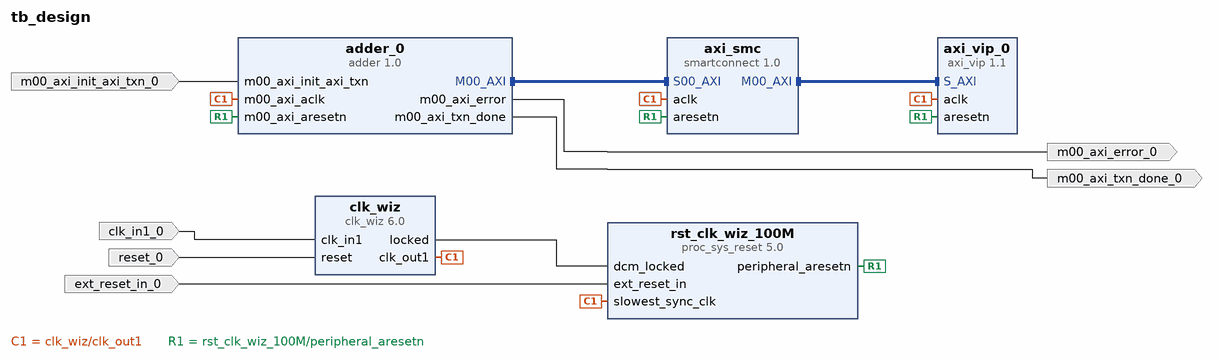
[diagram p0: block diagram of the top level]
# Vivado block design tb_design, xcvu13p-fhgb2104-2-e, Vivado 2025.2
create_bd_design tb_design

create_bd_port -dir I m00_axi_init_axi_txn_0
create_bd_port -dir O m00_axi_txn_done_0
create_bd_port -dir O m00_axi_error_0
create_bd_port -dir I -type clk clk_in1_0
create_bd_port -dir I -type rst reset_0
set_property -dict {CONFIG.POLARITY ACTIVE_HIGH} [get_bd_ports reset_0]
create_bd_port -dir I -type rst ext_reset_in_0

create_bd_cell -type ip -vlnv user.org:user:adder:1.0 adder_0
set_property -dict [list \
  CONFIG.C_M00_AXI_ARUSER_WIDTH 0 \
  CONFIG.C_M00_AXI_AWUSER_WIDTH 0 \
  CONFIG.C_M00_AXI_BURST_LEN 1 \
  CONFIG.C_M00_AXI_BUSER_WIDTH 0 \
  CONFIG.C_M00_AXI_RUSER_WIDTH 0 \
  CONFIG.C_M00_AXI_WUSER_WIDTH 0 \
] [get_bd_cells adder_0]
create_bd_cell -type ip -vlnv xilinx.com:ip:axi_vip:1.1 axi_vip_0
set_property -dict {CONFIG.INTERFACE_MODE SLAVE} [get_bd_cells axi_vip_0]
create_bd_cell -type ip -vlnv xilinx.com:ip:smartconnect:1.0 axi_smc
set_property -dict {CONFIG.NUM_SI 1} [get_bd_cells axi_smc]
create_bd_cell -type ip -vlnv xilinx.com:ip:clk_wiz:6.0 clk_wiz
create_bd_cell -type ip -vlnv xilinx.com:ip:proc_sys_reset:5.0 rst_clk_wiz_100M

# ---- connections ----

connect_bd_intf_net [get_bd_intf_pins adder_0/M00_AXI] [get_bd_intf_pins axi_smc/S00_AXI]
connect_bd_intf_net [get_bd_intf_pins axi_smc/M00_AXI] [get_bd_intf_pins axi_vip_0/S_AXI]
connect_bd_net [get_bd_pins adder_0/m00_axi_error] [get_bd_ports m00_axi_error_0]
connect_bd_net [get_bd_pins adder_0/m00_axi_txn_done] [get_bd_ports m00_axi_txn_done_0]
connect_bd_net -net clk_in1_0_1 [get_bd_ports clk_in1_0] [get_bd_pins clk_wiz/clk_in1]
connect_bd_net [get_bd_pins clk_wiz/clk_out1] \
  [get_bd_pins adder_0/m00_axi_aclk] [get_bd_pins axi_smc/aclk] [get_bd_pins axi_vip_0/aclk] \
  [get_bd_pins rst_clk_wiz_100M/slowest_sync_clk]
connect_bd_net [get_bd_pins clk_wiz/locked] [get_bd_pins rst_clk_wiz_100M/dcm_locked]
connect_bd_net -net ext_reset_in_0_1 [get_bd_ports ext_reset_in_0] [get_bd_pins rst_clk_wiz_100M/ext_reset_in]
connect_bd_net -net m00_axi_init_axi_txn_0_1 [get_bd_ports m00_axi_init_axi_txn_0] [get_bd_pins adder_0/m00_axi_init_axi_txn]
connect_bd_net -net reset_0_1 [get_bd_ports reset_0] [get_bd_pins clk_wiz/reset]
connect_bd_net [get_bd_pins rst_clk_wiz_100M/peripheral_aresetn] \
  [get_bd_pins adder_0/m00_axi_aresetn] [get_bd_pins axi_smc/aresetn] [get_bd_pins axi_vip_0/aresetn]

# ---- address map ----
assign_bd_address -offset 0x40000000 -range 1G -target_address_space [get_bd_addr_spaces adder_0/M00_AXI] [get_bd_addr_segs axi_vip_0/S_AXI/Reg]

validate_bd_design
save_bd_design
